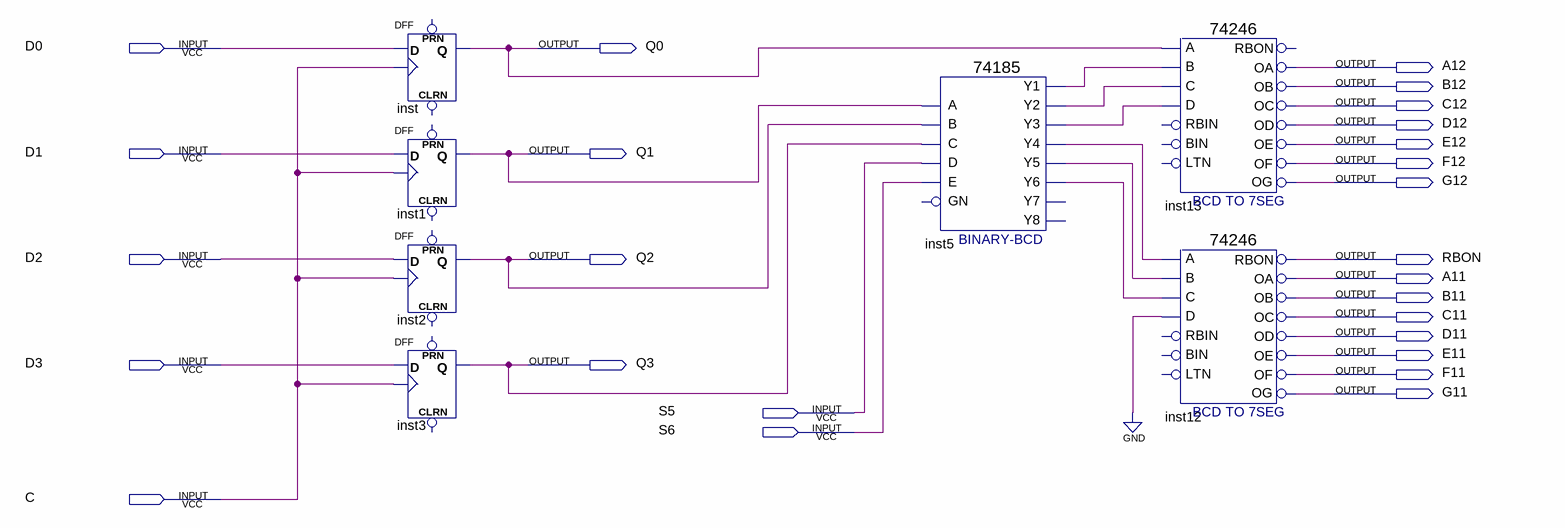
[diagram p0: schematic sheet]
// Quartus schematic project13.bdf as structural Verilog: 7 symbols, 26 pins
module project13 (
  input  D0,
  input  D1,
  input  D2,
  input  D3,
  input  S5,
  input  S6,
  input  C,
  output Q0,
  output A12,
  output B12,
  output C12,
  output D12,
  output E12,
  output Q1,
  output F12,
  output G12,
  output Q2,
  output RBON,
  output A11,
  output B11,
  output C11,
  output D11,
  output E11,
  output Q3,
  output F11,
  output G11
);

  wire inst5_y1, inst5_y2, inst5_y3, inst5_y4, inst5_y5, inst5_y6;

  DFF inst (.CLK(C), .D(D0), .Q(Q0));  // open: CLRN, PRN
  DFF inst1 (.CLK(C), .D(D1), .Q(Q1));  // open: CLRN, PRN
  DFF inst2 (.CLK(C), .D(D2), .Q(Q2));  // open: CLRN, PRN
  DFF inst3 (.CLK(C), .D(D3), .Q(Q3));  // open: CLRN, PRN
  \74185  inst5 (
    .A(Q1), .B(Q2), .D(S5), .C(Q3), .E(S6), .Y1(inst5_y1), .Y3(inst5_y3), .Y2(inst5_y2), .Y5(inst5_y5),
    .Y4(inst5_y4), .Y6(inst5_y6));  // open: GN, Y8, Y7
  \74246  inst13 (
    .B(inst5_y1), .A(Q0), .D(inst5_y3), .C(inst5_y2), .OD(D12), .OC(C12), .OB(B12), .OE(E12), .OF(F12),
    .OA(A12), .OG(G12));  // open: RBIN, LTN, BIN, RBON
  \74246  inst12 (
    .B(inst5_y5), .A(inst5_y4), .D(1'b0), .C(inst5_y6), .OD(D11), .RBON(RBON), .OC(C11), .OB(B11), .OE(E11),
    .OF(F11), .OA(A11), .OG(G11));  // open: RBIN, LTN, BIN
endmodule
